# Altium schematic sheet PART1.SchDoc
size 558 x 431 mm
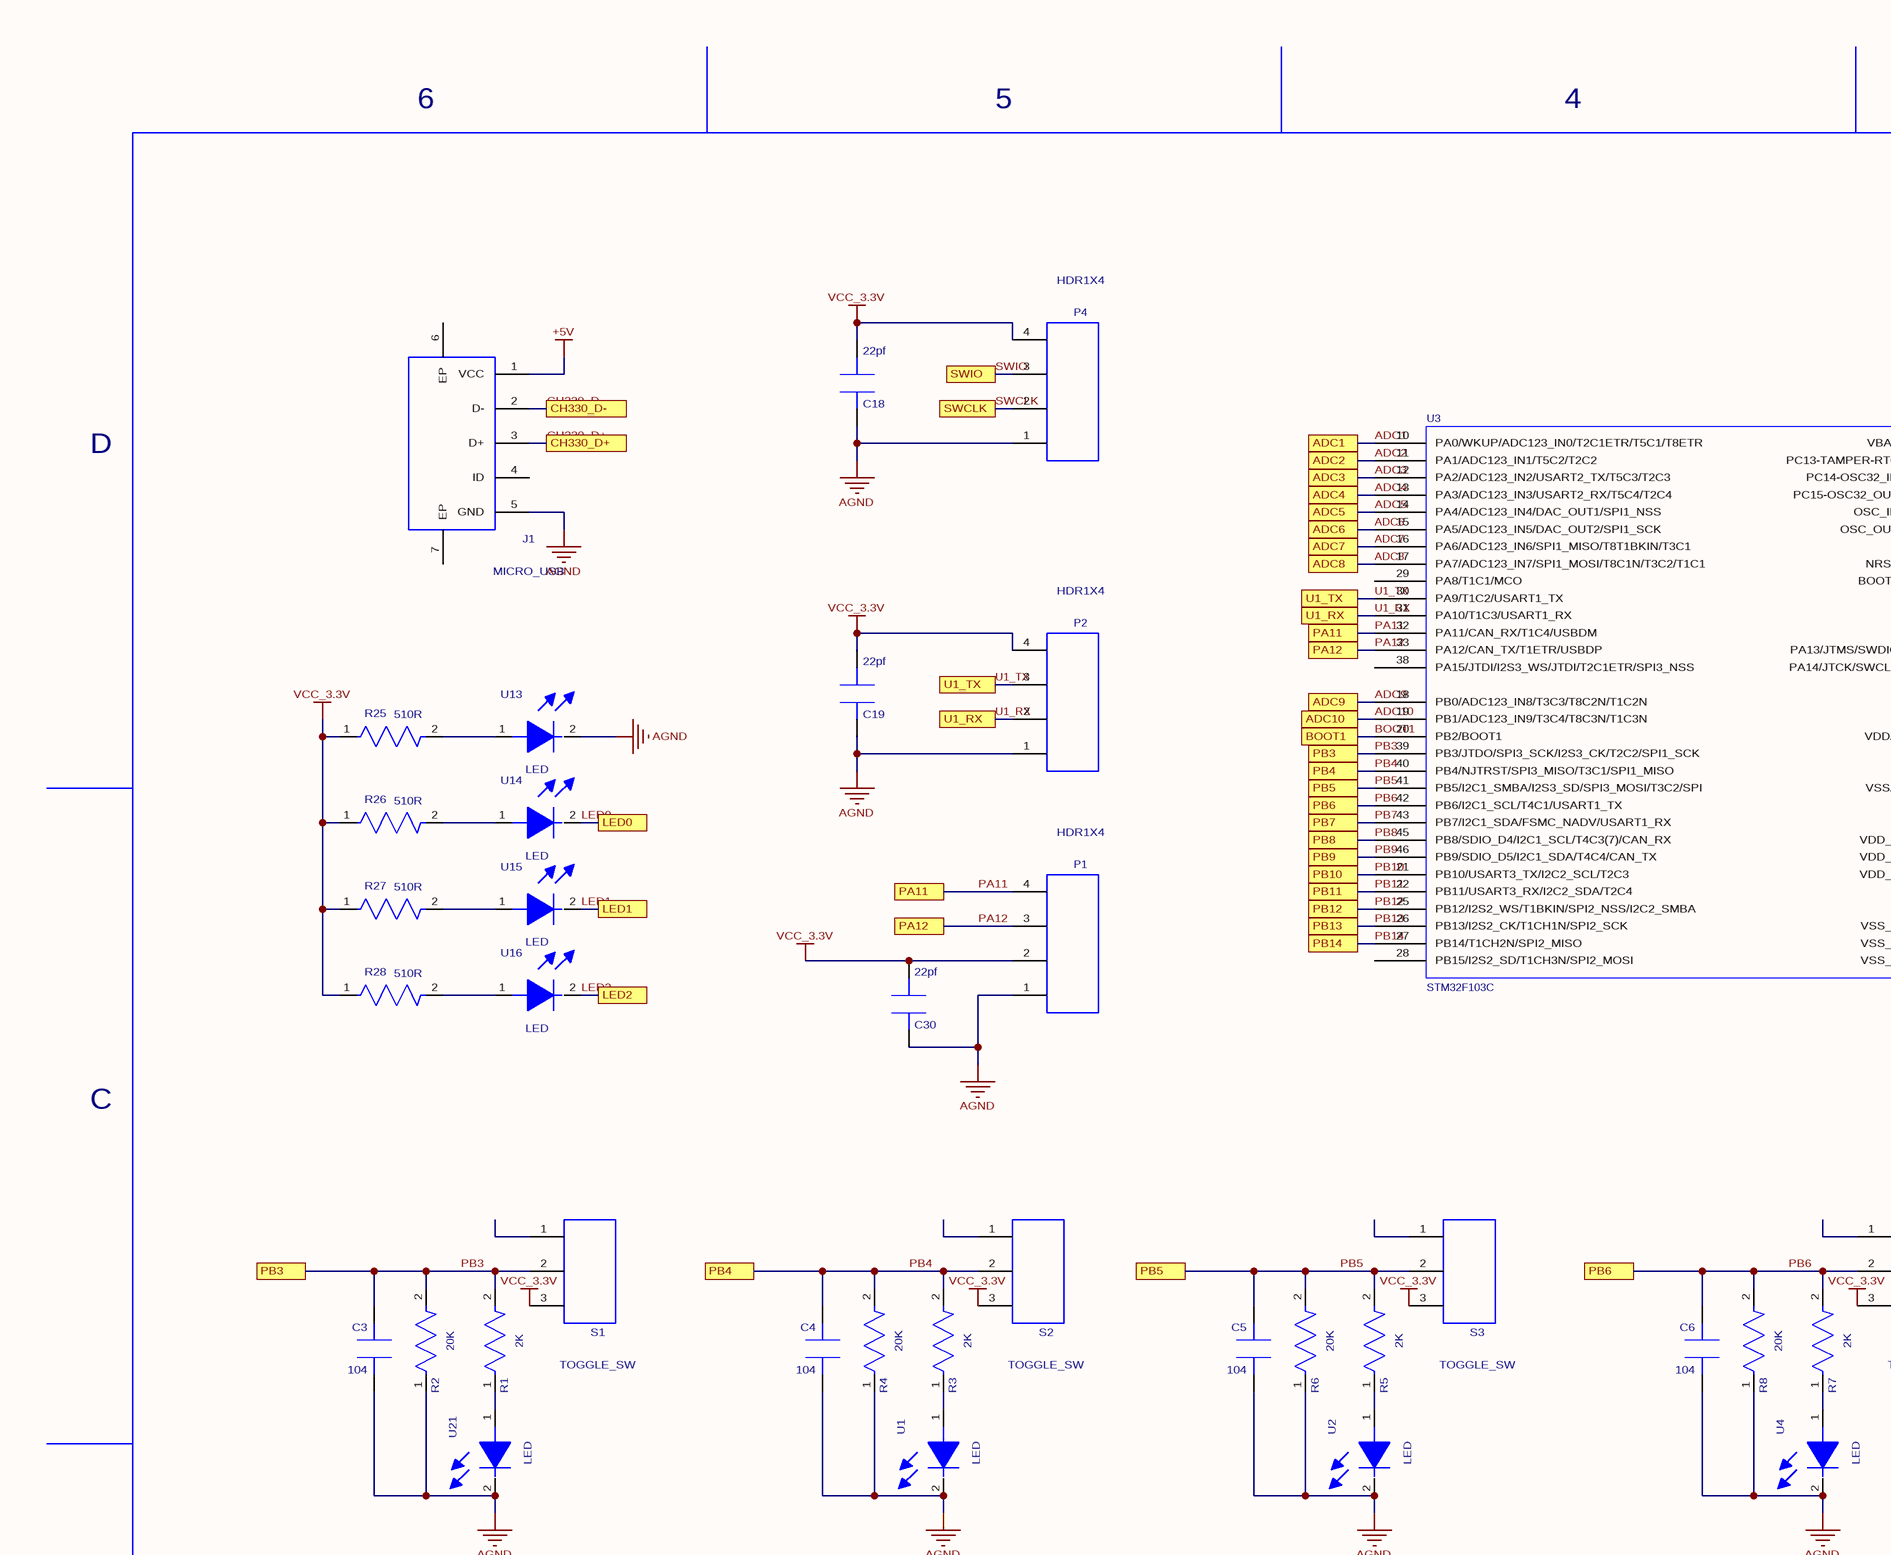
[diagram p0: PART1.SchDoc, top left]
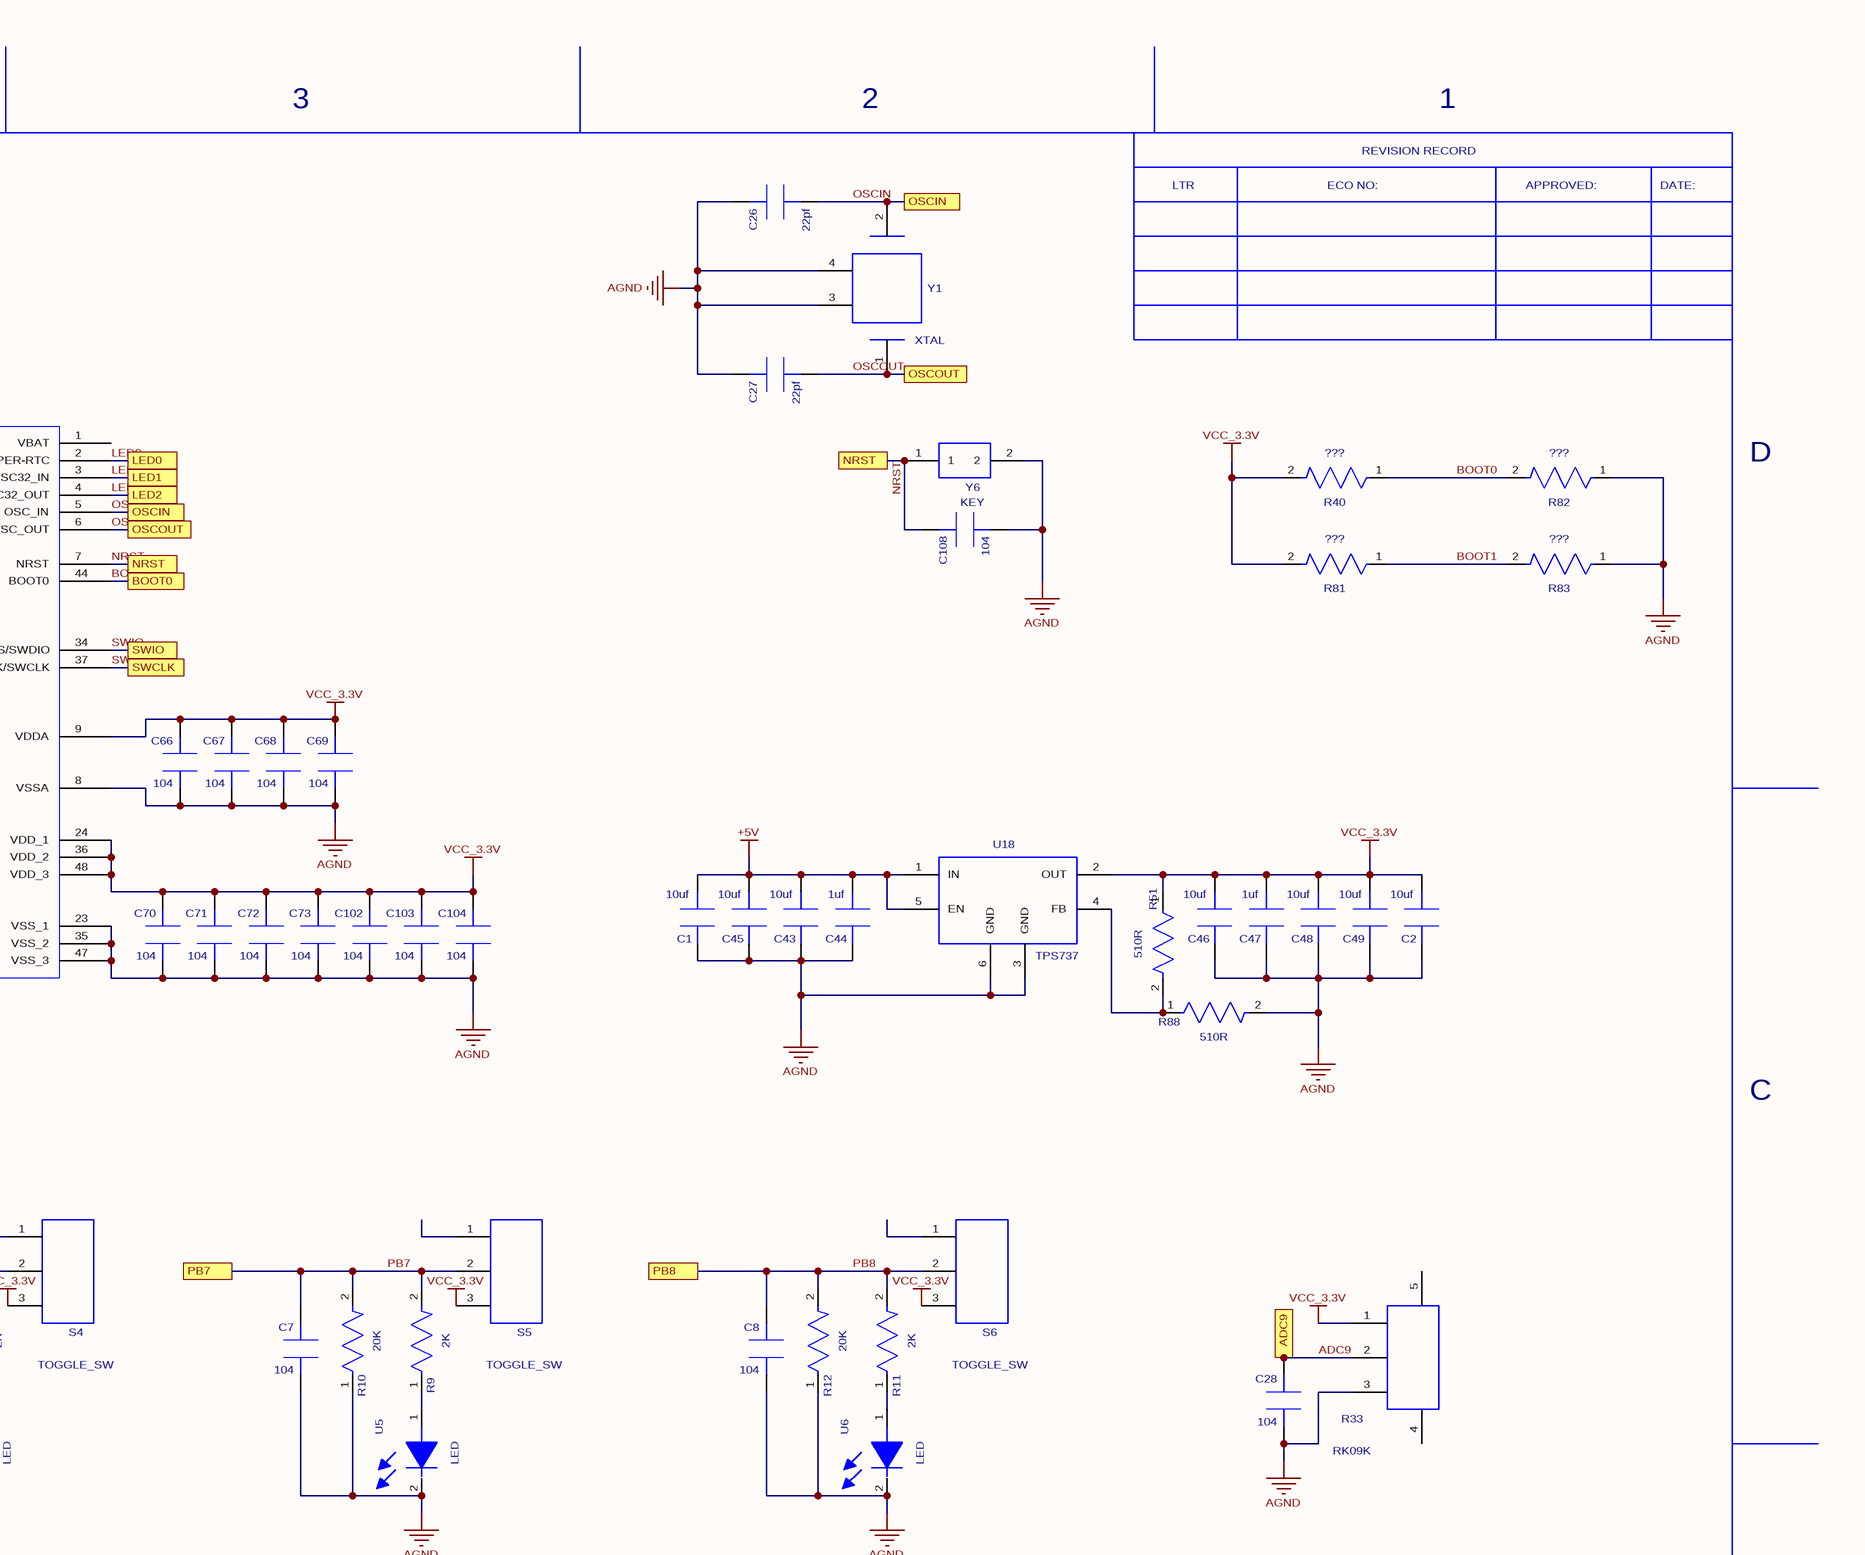
[diagram p1: PART1.SchDoc, top right]
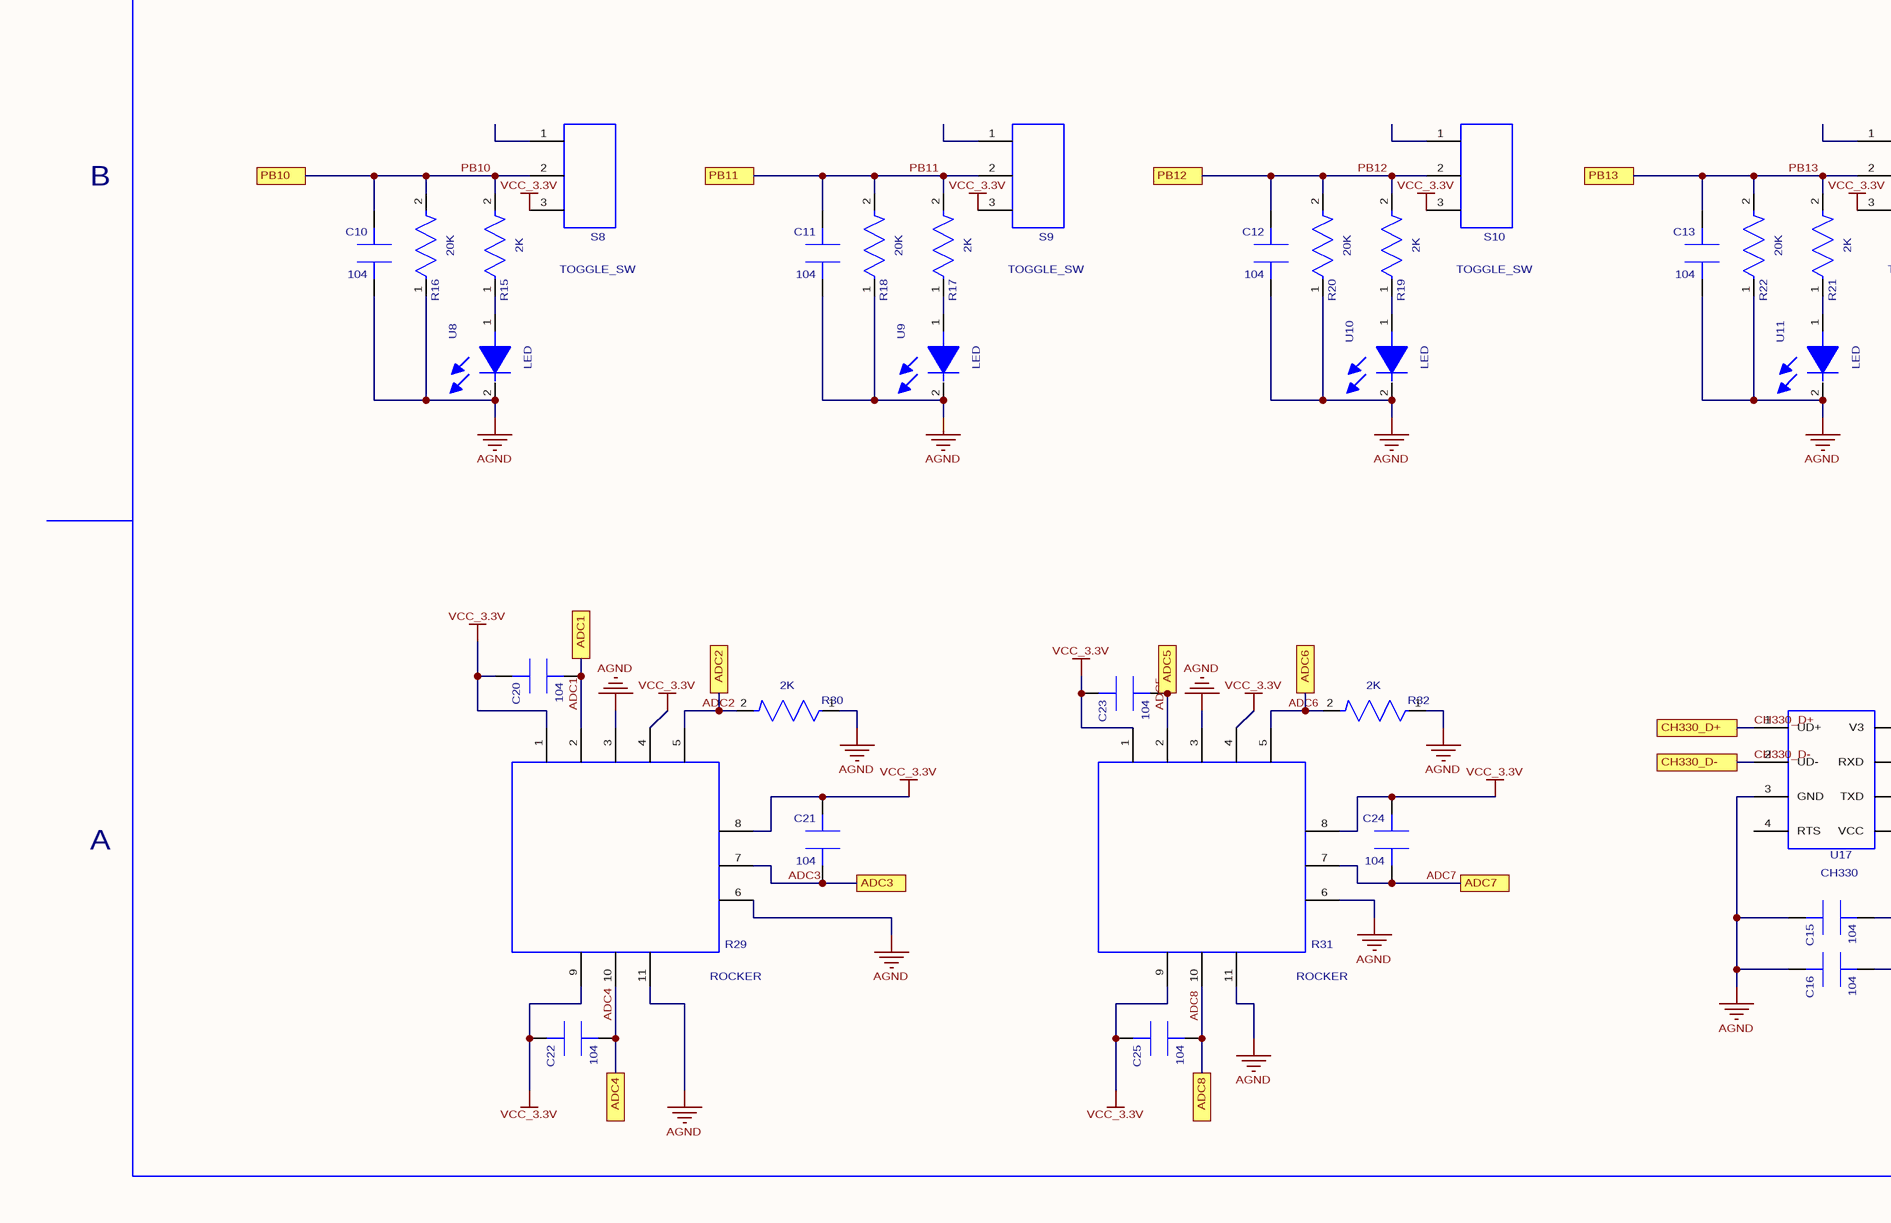
[diagram p2: PART1.SchDoc, bottom left]
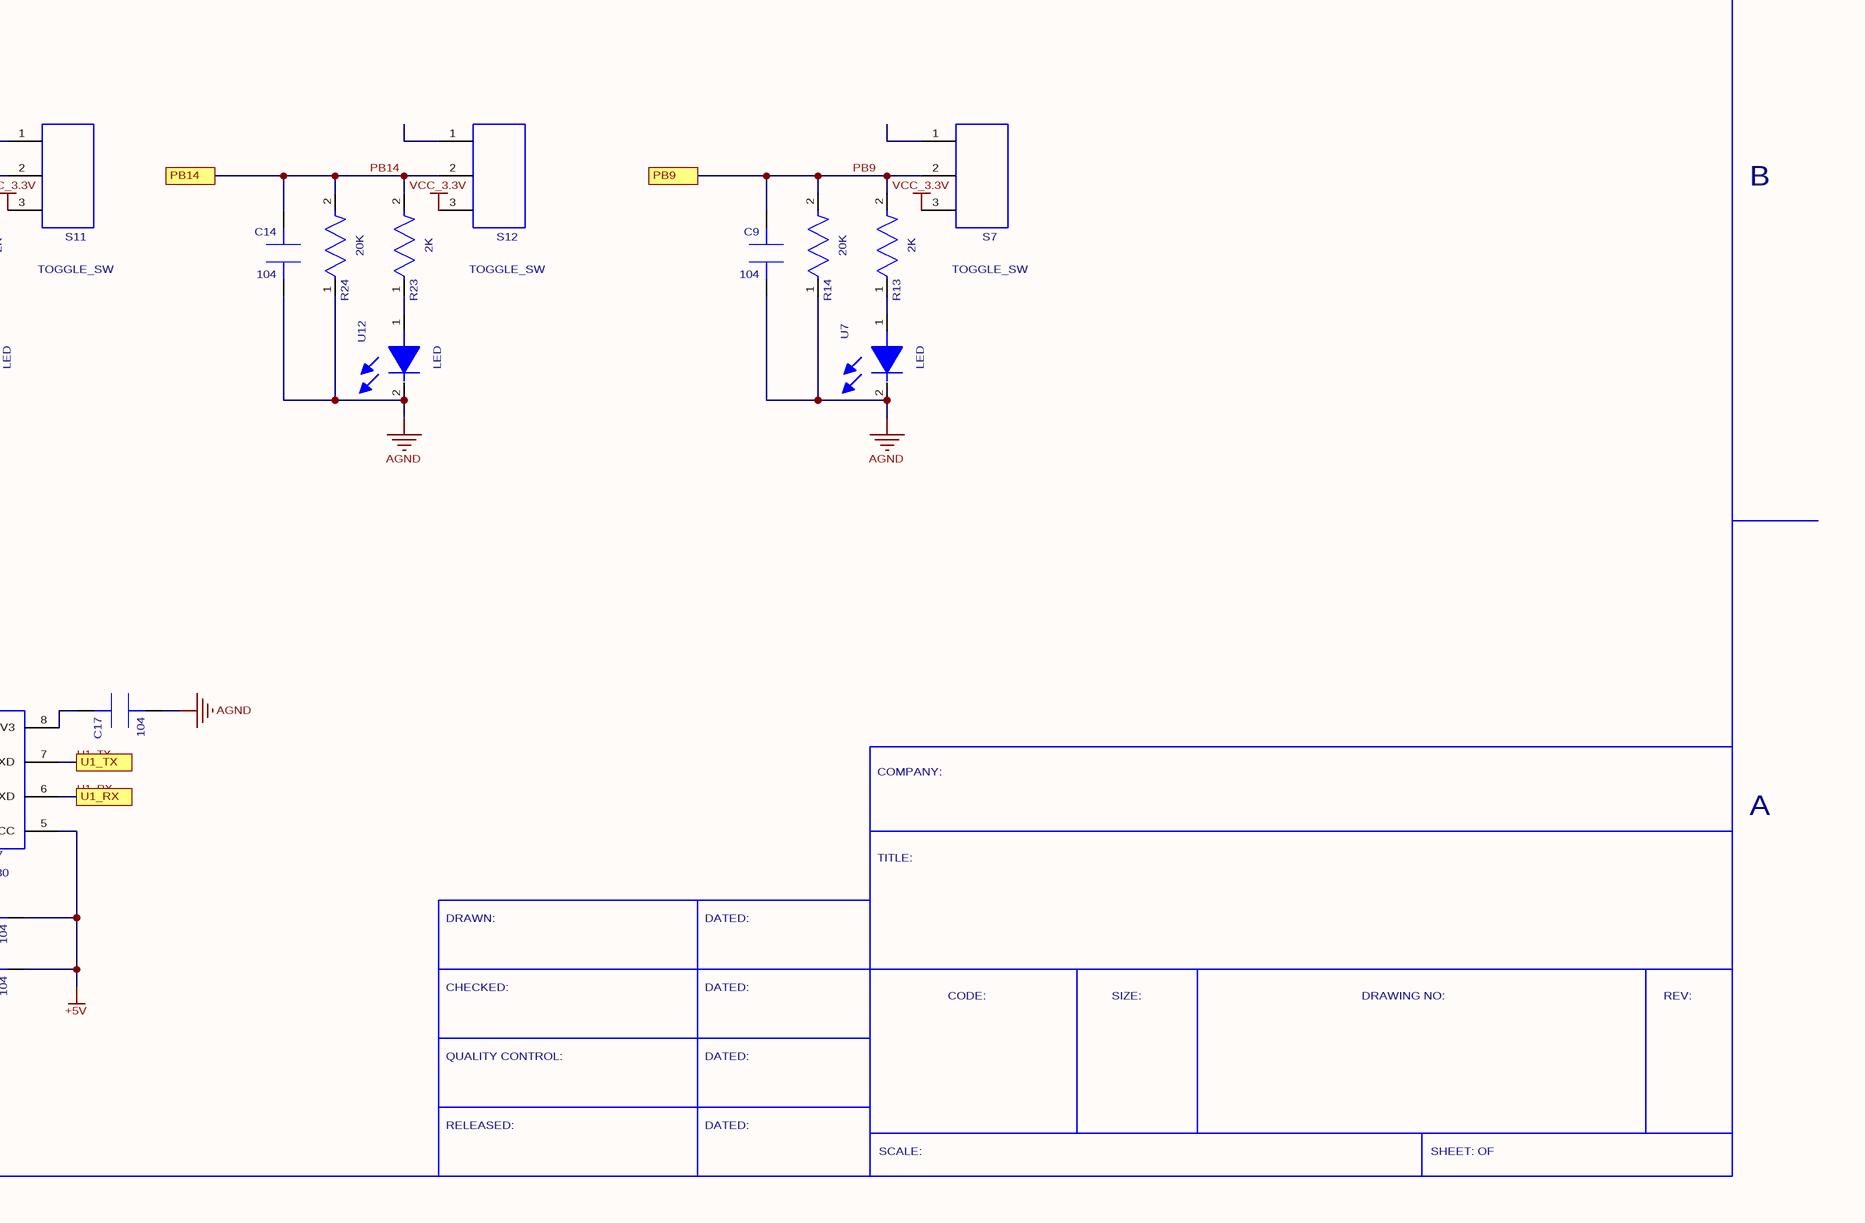
[diagram p3: PART1.SchDoc, bottom right]

## Parts
C1  value 10uf  [1206C]  (hidden comment: CAP-CFR04R-C)
C2  value 10uf  [1206C]  (hidden comment: CAP-CFR04R-C)
C3  value 104  [0603C]  (hidden comment: CAP-CFR04R-C)
C4  value 104  [0603C]  (hidden comment: CAP-CFR04R-C)
C5  value 104  [0603C]  (hidden comment: CAP-CFR04R-C)
C6  value 104  [0603C]  (hidden comment: CAP-CFR04R-C)
C7  value 104  [0603C]  (hidden comment: CAP-CFR04R-C)
C8  value 104  [0603C]  (hidden comment: CAP-CFR04R-C)
C9  value 104  [0603C]  (hidden comment: CAP-CFR04R-C)
C10  value 104  [0603C]  (hidden comment: CAP-CFR04R-C)
C11  value 104  [0603C]  (hidden comment: CAP-CFR04R-C)
C12  value 104  [0603C]  (hidden comment: CAP-CFR04R-C)
C13  value 104  [0603C]  (hidden comment: CAP-CFR04R-C)
C14  value 104  [0603C]  (hidden comment: CAP-CFR04R-C)
C15  value 104  [0603C]  (hidden comment: CAP-CFR04R-C)
C16  value 104  [0805C]  (hidden comment: CAP-CFR04R-C)
C17  value 104  [0603C]  (hidden comment: CAP-CFR04R-C)
C18  value 22pf  [0603C]  (hidden comment: CAP-CFR04R-C)
C19  value 22pf  [0603C]  (hidden comment: CAP-CFR04R-C)
C20  value 104  [0805C]  (hidden comment: CAP-CFR04R-C)
C21  value 104  [0805C]  (hidden comment: CAP-CFR04R-C)
C22  value 104  [0805C]  (hidden comment: CAP-CFR04R-C)
C23  value 104  [0805C]  (hidden comment: CAP-CFR04R-C)
C24  value 104  [0805C]  (hidden comment: CAP-CFR04R-C)
C25  value 104  [0805C]  (hidden comment: CAP-CFR04R-C)
C26  value 22pf  [0603C]  (hidden comment: CAP-CFR04R-C)
C27  value 22pf  [0603C]  (hidden comment: CAP-CFR04R-C)
C28  value 104  [0603C]  (hidden comment: CAP-CFR04R-C)
C30  value 22pf  [0603C]  (hidden comment: CAP-CFR04R-C)
C43  value 10uf  [1206C]  (hidden comment: CAP-CFR04R-C)
C44  value 1uf  [0805C]  (hidden comment: CAP-CFR04R-C)
C45  value 10uf  [1206C]  (hidden comment: CAP-CFR04R-C)
C46  value 10uf  [1206C]  (hidden comment: CAP-CFR04R-C)
C47  value 1uf  [0805C]  (hidden comment: CAP-CFR04R-C)
C48  value 10uf  [1206C]  (hidden comment: CAP-CFR04R-C)
C49  value 10uf  [1206C]  (hidden comment: CAP-CFR04R-C)
C66  value 104  [0805C]  (hidden comment: CAP-CFR04R-C)
C67  value 104  [0805C]  (hidden comment: CAP-CFR04R-C)
C68  value 104  [0805C]  (hidden comment: CAP-CFR04R-C)
C69  value 104  [0805C]  (hidden comment: CAP-CFR04R-C)
C70  value 104  [0805C]  (hidden comment: CAP-CFR04R-C)
C71  value 104  [0805C]  (hidden comment: CAP-CFR04R-C)
C72  value 104  [0805C]  (hidden comment: CAP-CFR04R-C)
C73  value 104  [0805C]  (hidden comment: CAP-CFR04R-C)
C102  value 104  [0805C]  (hidden comment: CAP-CFR04R-C)
C103  value 104  [0805C]  (hidden comment: CAP-CFR04R-C)
C104  value 104  [0805C]  (hidden comment: CAP-CFR04R-C)
C108  value 104  [0805C]  (hidden comment: CAP-CFR04R-C)
J1  MICRO_USB  [MICRO_USB]
P1  HDR1X4  [HDR1X4(2)]
P2  HDR1X4  [HDR1X4(2)]
P4  HDR1X4  [HDR1X4(2)]
R1  value 2K  [0603R]  (hidden comment: RES-WR1)
R2  value 20K  [0603R]  (hidden comment: RES-WR1)
R3  value 2K  [0603R]  (hidden comment: RES-WR1)
R4  value 20K  [0603R]  (hidden comment: RES-WR1)
R5  value 2K  [0603R]  (hidden comment: RES-WR1)
R6  value 20K  [0603R]  (hidden comment: RES-WR1)
R7  value 2K  [0603R]  (hidden comment: RES-WR1)
R8  value 20K  [0603R]  (hidden comment: RES-WR1)
R9  value 2K  [0603R]  (hidden comment: RES-WR1)
R10  value 20K  [0603R]  (hidden comment: RES-WR1)
R11  value 2K  [0603R]  (hidden comment: RES-WR1)
R12  value 20K  [0603R]  (hidden comment: RES-WR1)
R13  value 2K  [0603R]  (hidden comment: RES-WR1)
R14  value 20K  [0603R]  (hidden comment: RES-WR1)
R15  value 2K  [0603R]  (hidden comment: RES-WR1)
R16  value 20K  [0603R]  (hidden comment: RES-WR1)
R17  value 2K  [0603R]  (hidden comment: RES-WR1)
R18  value 20K  [0603R]  (hidden comment: RES-WR1)
R19  value 2K  [0603R]  (hidden comment: RES-WR1)
R20  value 20K  [0603R]  (hidden comment: RES-WR1)
R21  value 2K  [0603R]  (hidden comment: RES-WR1)
R22  value 20K  [0603R]  (hidden comment: RES-WR1)
R23  value 2K  [0603R]  (hidden comment: RES-WR1)
R24  value 20K  [0603R]  (hidden comment: RES-WR1)
R25  value 510R  [0603R]  (hidden comment: RES-WR1)
R26  value 510R  [0603R]  (hidden comment: RES-WR1)
R27  value 510R  [0603R]  (hidden comment: RES-WR1)
R28  value 510R  [0603R]  (hidden comment: RES-WR1)
R29  ROCKER  [ROCKER]
R30  value 2K  [0603R]  (hidden comment: RES-WR1)
R31  ROCKER  [ROCKER]
R32  value 2K  [0603R]  (hidden comment: RES-WR1)
R33  RK09K  [RK09K_RES]
R40  value ???  [0603R]  (hidden comment: RES-WR1)
R51  value 510R  [0603R]  (hidden comment: RES-WR1)
R81  value ???  [0603R]  (hidden comment: RES-WR1)
R82  value ???  [0603R]  (hidden comment: RES-WR1)
R83  value ???  [0603R]  (hidden comment: RES-WR1)
R88  value 510R  [0603R]  (hidden comment: RES-WR1)
S1  TOGGLE_SW  [TOGGLE_SWITCH]
S2  TOGGLE_SW  [TOGGLE_SWITCH]
S3  TOGGLE_SW  [TOGGLE_SWITCH]
S4  TOGGLE_SW  [TOGGLE_SWITCH]
S5  TOGGLE_SW  [TOGGLE_SWITCH]
S6  TOGGLE_SW  [TOGGLE_SWITCH]
S7  TOGGLE_SW  [TOGGLE_SWITCH]
S8  TOGGLE_SW  [TOGGLE_SWITCH]
S9  TOGGLE_SW  [TOGGLE_SWITCH]
S10  TOGGLE_SW  [TOGGLE_SWITCH]
S11  TOGGLE_SW  [TOGGLE_SWITCH]
S12  TOGGLE_SW  [TOGGLE_SWITCH]
U1  DS0  [0805D]  (value not drawn)
U2  DS0  [0805D]  (value not drawn)
U3  STM32F103C  [LQFP-48_M]
U4  DS0  [0805D]  (value not drawn)
U5  DS0  [0805D]  (value not drawn)
U6  DS0  [0805D]  (value not drawn)
U7  DS0  [0805D]  (value not drawn)
U8  DS0  [0805D]  (value not drawn)
U9  DS0  [0805D]  (value not drawn)
U10  DS0  [0805D]  (value not drawn)
U11  DS0  [0805D]  (value not drawn)
U12  DS0  [0805D]  (value not drawn)
U13  DS0  [0805D]  (value not drawn)
U14  DS0  [0805D]  (value not drawn)
U15  DS0  [0805D]  (value not drawn)
U16  DS0  [0805D]  (value not drawn)
U17  CH330  [SOP_8]
U18  TPS737  [SOT-223-6_L6.5-W3.5-P1.27-BL]
U21  DS0  [0805D]  (value not drawn)
Y1  XTAL  [XTAL3]
Y6  KEY  [KEY_3_6_2.5]

## Ports
ADC1, ADC2, ADC3, ADC4, ADC5, ADC6, ADC7, ADC8, ADC9, ADC10, BOOT0, BOOT1, CH330_D+, CH330_D-, LED0, LED1, LED2, NRST, OSCIN, OSCOUT, PA11, PA12, PB3, PB4, PB5, PB6, PB7, PB8, PB9, PB10, PB11, PB12, PB13, PB14, SWCLK, SWIO, U1_RX, U1_TX

## Nets
+5V: C1.2 C15.2 C16.2 C43.2 C44.2 C45.2 J1.1(VCC) U17.5(VCC) U18.1(IN) U18.5(EN)
AGND: C1.1 C2.1 C3.2 C4.2 C5.2 C6.2 C7.2 C8.2 C9.2 C10.2 C11.2 C12.2 C13.2 C14.2 C15.1 C16.1 C17.2 C18.1 C19.1 C26.1 C27.1 C28.2 C30.1 C43.1 C44.1 C45.1 C46.1 C47.1 C48.1 C49.1 C66.2 C67.2 C68.2 C69.2 C70.2 C71.2 C72.2 C73.2 C102.2 C103.2 C104.2 C108.2 J1.5(GND) P1.1 P2.1 P4.1 R2.1 R4.1 R6.1 R8.1 R10.1 R12.1 R14.1 R16.1 R18.1 R20.1 R22.1 R24.1 R29.3 R29.6 R29.11 R30.1 R31.3 R31.6 R31.11 R32.1 R33.3 R82.1 R83.1 R88.2 U1.2 U2.2 U3.8(VSSA) U3.23(VSS_1) U3.35(VSS_2) U3.47(VSS_3) U4.2 U5.2 U6.2 U7.2 U8.2 U9.2 U10.2 U11.2 U12.2 U13.2 U17.3(GND) U18.3(GND) U18.6(GND) U21.2 Y1.3 Y1.4 Y6.2
VCC_3.3V: C2.2 C18.2 C19.2 C20.1 C21.1 C22.1 C23.1 C24.1 C25.1 C30.2 C46.2 C47.2 C48.2 C49.2 C66.1 C67.1 C68.1 C69.1 C70.1 C71.1 C72.1 C73.1 C102.1 C103.1 C104.1 P1.2 P2.4 P4.4 R25.1 R26.1 R27.1 R28.1 R29.1 R29.4 R29.8 R29.9 R31.1 R31.4 R31.8 R31.9 R33.1 R40.2 R51.1 R81.2 S1.3 S2.3 S3.3 S4.3 S5.3 S6.3 S7.3 S8.3 S9.3 S10.3 S11.3 S12.3 U3.9(VDDA) U3.24(VDD_1) U3.36(VDD_2) U3.48(VDD_3) U18.2(OUT)
ADC1: C20.2 R29.2 U3.10(PA0/WKUP/ADC123_IN0/T2C1ETR/T5C1/T8ETR) ; port ADC1
ADC2: R29.5 R30.2 U3.11(PA1/ADC123_IN1/T5C2/T2C2) ; port ADC2
ADC3: C21.2 R29.7 U3.12(PA2/ADC123_IN2/USART2_TX/T5C3/T2C3) ; port ADC3
ADC4: C22.2 R29.10 U3.13(PA3/ADC123_IN3/USART2_RX/T5C4/T2C4) ; port ADC4
ADC5: C23.2 R31.2 U3.14(PA4/ADC123_IN4/DAC_OUT1/SPI1_NSS) ; port ADC5
ADC6: R31.5 R32.2 U3.15(PA5/ADC123_IN5/DAC_OUT2/SPI1_SCK) ; port ADC6
ADC7: C24.2 R31.7 U3.16(PA6/ADC123_IN6/SPI1_MISO/T8T1BKIN/T3C1) ; port ADC7
ADC8: C25.2 R31.10 U3.17(PA7/ADC123_IN7/SPI1_MOSI/T8C1N/T3C2/T1C1) ; port ADC8
ADC9: C28.1 R33.2 U3.18(PB0/ADC123_IN8/T3C3/T8C2N/T1C2N) ; port ADC9
ADC10: U3.19(PB1/ADC123_IN9/T3C4/T8C3N/T1C3N) ; port ADC10
BOOT0: R40.1 R82.2 U3.44(BOOT0) ; port BOOT0
BOOT1: R81.1 R83.2 U3.20(PB2/BOOT1) ; port BOOT1
CH330_D+: J1.3(D+) U17.1(UD+) ; port CH330_D+
CH330_D-: J1.2(D-) U17.2(UD-) ; port CH330_D-
LED0: U3.2(PC13-TAMPER-RTC) U14.2 ; port LED0
LED1: U3.3(PC14-OSC32_IN) U15.2 ; port LED1
LED2: U3.4(PC15-OSC32_OUT) U16.2 ; port LED2
NRST: C108.1 U3.7(NRST) Y6.1 ; port NRST
OSCIN: C26.2 U3.5(OSC_IN) Y1.2 ; port OSCIN
OSCOUT: C27.2 U3.6(OSC_OUT) Y1.1 ; port OSCOUT
PA11: P1.4 U3.32(PA11/CAN_RX/T1C4/USBDM) ; port PA11
PA12: P1.3 U3.33(PA12/CAN_TX/T1ETR/USBDP) ; port PA12
PB3: C3.1 R1.2 R2.2 S1.2 U3.39(PB3/JTDO/SPI3_SCK/I2S3_CK/T2C2/SPI1_SCK) ; port PB3
PB4: C4.1 R3.2 R4.2 S2.2 U3.40(PB4/NJTRST/SPI3_MISO/T3C1/SPI1_MISO) ; port PB4
PB5: C5.1 R5.2 R6.2 S3.2 U3.41(PB5/I2C1_SMBA/I2S3_SD/SPI3_MOSI/T3C2/SPI) ; port PB5
PB6: C6.1 R7.2 R8.2 S4.2 U3.42(PB6/I2C1_SCL/T4C1/USART1_TX) ; port PB6
PB7: C7.1 R9.2 R10.2 S5.2 U3.43(PB7/I2C1_SDA/FSMC_NADV/USART1_RX) ; port PB7
PB8: C8.1 R11.2 R12.2 S6.2 U3.45(PB8/SDIO_D4/I2C1_SCL/T4C3(7)/CAN_RX) ; port PB8
PB9: C9.1 R13.2 R14.2 S7.2 U3.46(PB9/SDIO_D5/I2C1_SDA/T4C4/CAN_TX) ; port PB9
PB10: C10.1 R15.2 R16.2 S8.2 U3.21(PB10/USART3_TX/I2C2_SCL/T2C3) ; port PB10
PB11: C11.1 R17.2 R18.2 S9.2 U3.22(PB11/USART3_RX/I2C2_SDA/T2C4) ; port PB11
PB12: C12.1 R19.2 R20.2 S10.2 U3.25(PB12/I2S2_WS/T1BKIN/SPI2_NSS/I2C2_SMBA) ; port PB12
PB13: C13.1 R21.2 R22.2 S11.2 U3.26(PB13/I2S2_CK/T1CH1N/SPI2_SCK) ; port PB13
PB14: C14.1 R23.2 R24.2 S12.2 U3.27(PB14/T1CH2N/SPI2_MISO) ; port PB14
SWCLK: P4.2 U3.37(PA14/JTCK/SWCLK) ; port SWCLK
SWIO: P4.3 U3.34(PA13/JTMS/SWDIO) ; port SWIO
U1_RX: P2.2 U3.31(PA10/T1C3/USART1_RX) U17.6(TXD) ; port U1_RX
U1_TX: P2.3 U3.30(PA9/T1C2/USART1_TX) U17.7(RXD) ; port U1_TX
NetC17_1: C17.1 U17.8(V3)
NetR1_1: R1.1 U21.1
NetR3_1: R3.1 U1.1
NetR5_1: R5.1 U2.1
NetR7_1: R7.1 U4.1
NetR9_1: R9.1 U5.1
NetR11_1: R11.1 U6.1
NetR13_1: R13.1 U7.1
NetR15_1: R15.1 U8.1
NetR17_1: R17.1 U9.1
NetR19_1: R19.1 U10.1
NetR21_1: R21.1 U11.1
NetR23_1: R23.1 U12.1
NetR25_2: R25.2 U13.1
NetR26_2: R26.2 U14.1
NetR27_2: R27.2 U15.1
NetR28_2: R28.2 U16.1
NetR51_2: R51.2 R88.1 U18.4(FB)

Not connected (* = marked no-connect by the designer): J1 4(ID) 6(EP) 7(EP); R33 4 5; S1 1; S2 1; S3 1; S4 1; S5 1; S6 1; S7 1; S8 1; S9 1; S10 1; S11 1; S12 1; U3 1(VBAT) 28(PB15/I2S2_SD/T1CH3N/SPI2_MOSI) 29(PA8/T1C1/MCO) 38(PA15/JTDI/I2S3_WS/JTDI/T2C1ETR/SPI3_NSS); U17 4(RTS)

## Notes on the sheet
- 6
- 5
- 4
- 3
- 2
- 1
- LTR
- ECO NO:
- REVISION RECORD
- APPROVED:
- DATE:
- D
- C
- B
- COMPANY:
- A
- TITLE:
- DRAWN:
- DATED:
- CHECKED:
- CODE:
- SIZE:
- DRAWING NO:
- REV:
- QUALITY CONTROL:
- RELEASED:
- SCALE:
- SHEET: OF

## Library data of the parts
C1-C28 C30 C43-C49 C66-C73 C102-C104 C108 = CAP-CFR04R-C: RADIAL FILM CAPACITOR, MIL-SPEC SIZE CFR04R SIZE 'C'; Manufacturer #1: KEMET; Part Number: TBD; Voltage Rating: ???; Sim.Analog.Prefix: C; Sim.Analog.Order: Model$; Tolerance: ???
  C1 C2 C43 C45 C46 C48 C49: PCB DECAL: 1206C
  C3-C15 C17-C19 C26-C28 C30: PCB DECAL: 0603C
  C16 C20-C25 C44 C47 C66-C73 C102-C104 C108: PCB DECAL: 0805C
J1 = MICRO_USB: PCB DECAL: MICRO-USB-SMD_5PBOARD5.9
R1-R28 R30 R32 R40 R51 R81-R83 R88 = RES-WR1: WIRE WOUND RESISTOR 3.4 X 7.05 MM; Manufacturer #1: IPC SM-782 STD.; Sim.Analog.Order: Model$; Sim.Analog.Prefix: R; PCB DECAL: 0603R
U1 U2 U4-U16 U21 = LED: Designator: LED; PCB DECAL: 0805D; Comment_1: LED
U3 = STM32F103C: STM32单片机48引脚; PCB DECAL: LQFP-48_M; Comment_1: STM32F103C
U17 = CH330: PCB DECAL: SOP-8
P1 P2 P4 = HDR1X4: PCB DECAL: HDR1X4
R29 R31 = ROCKER: PCB DECAL: ROCKER
R33 = RK09K: PCB DECAL: RK09K_RES
S1-S12 = TOGGLE_SW: PCB DECAL: TOGGLE_SWITCH
U18 = TPS737: PCB DECAL: SOT-223-6_L6.5-W3.5-P1.27-BL
Y1 = XTAL: PCB DECAL: XTAL
Y6 = KEY: PCB DECAL: KEY_3_6_2.5